# Altium schematic sheet PMP30825_RevB.SchDoc (part 2 of 2)
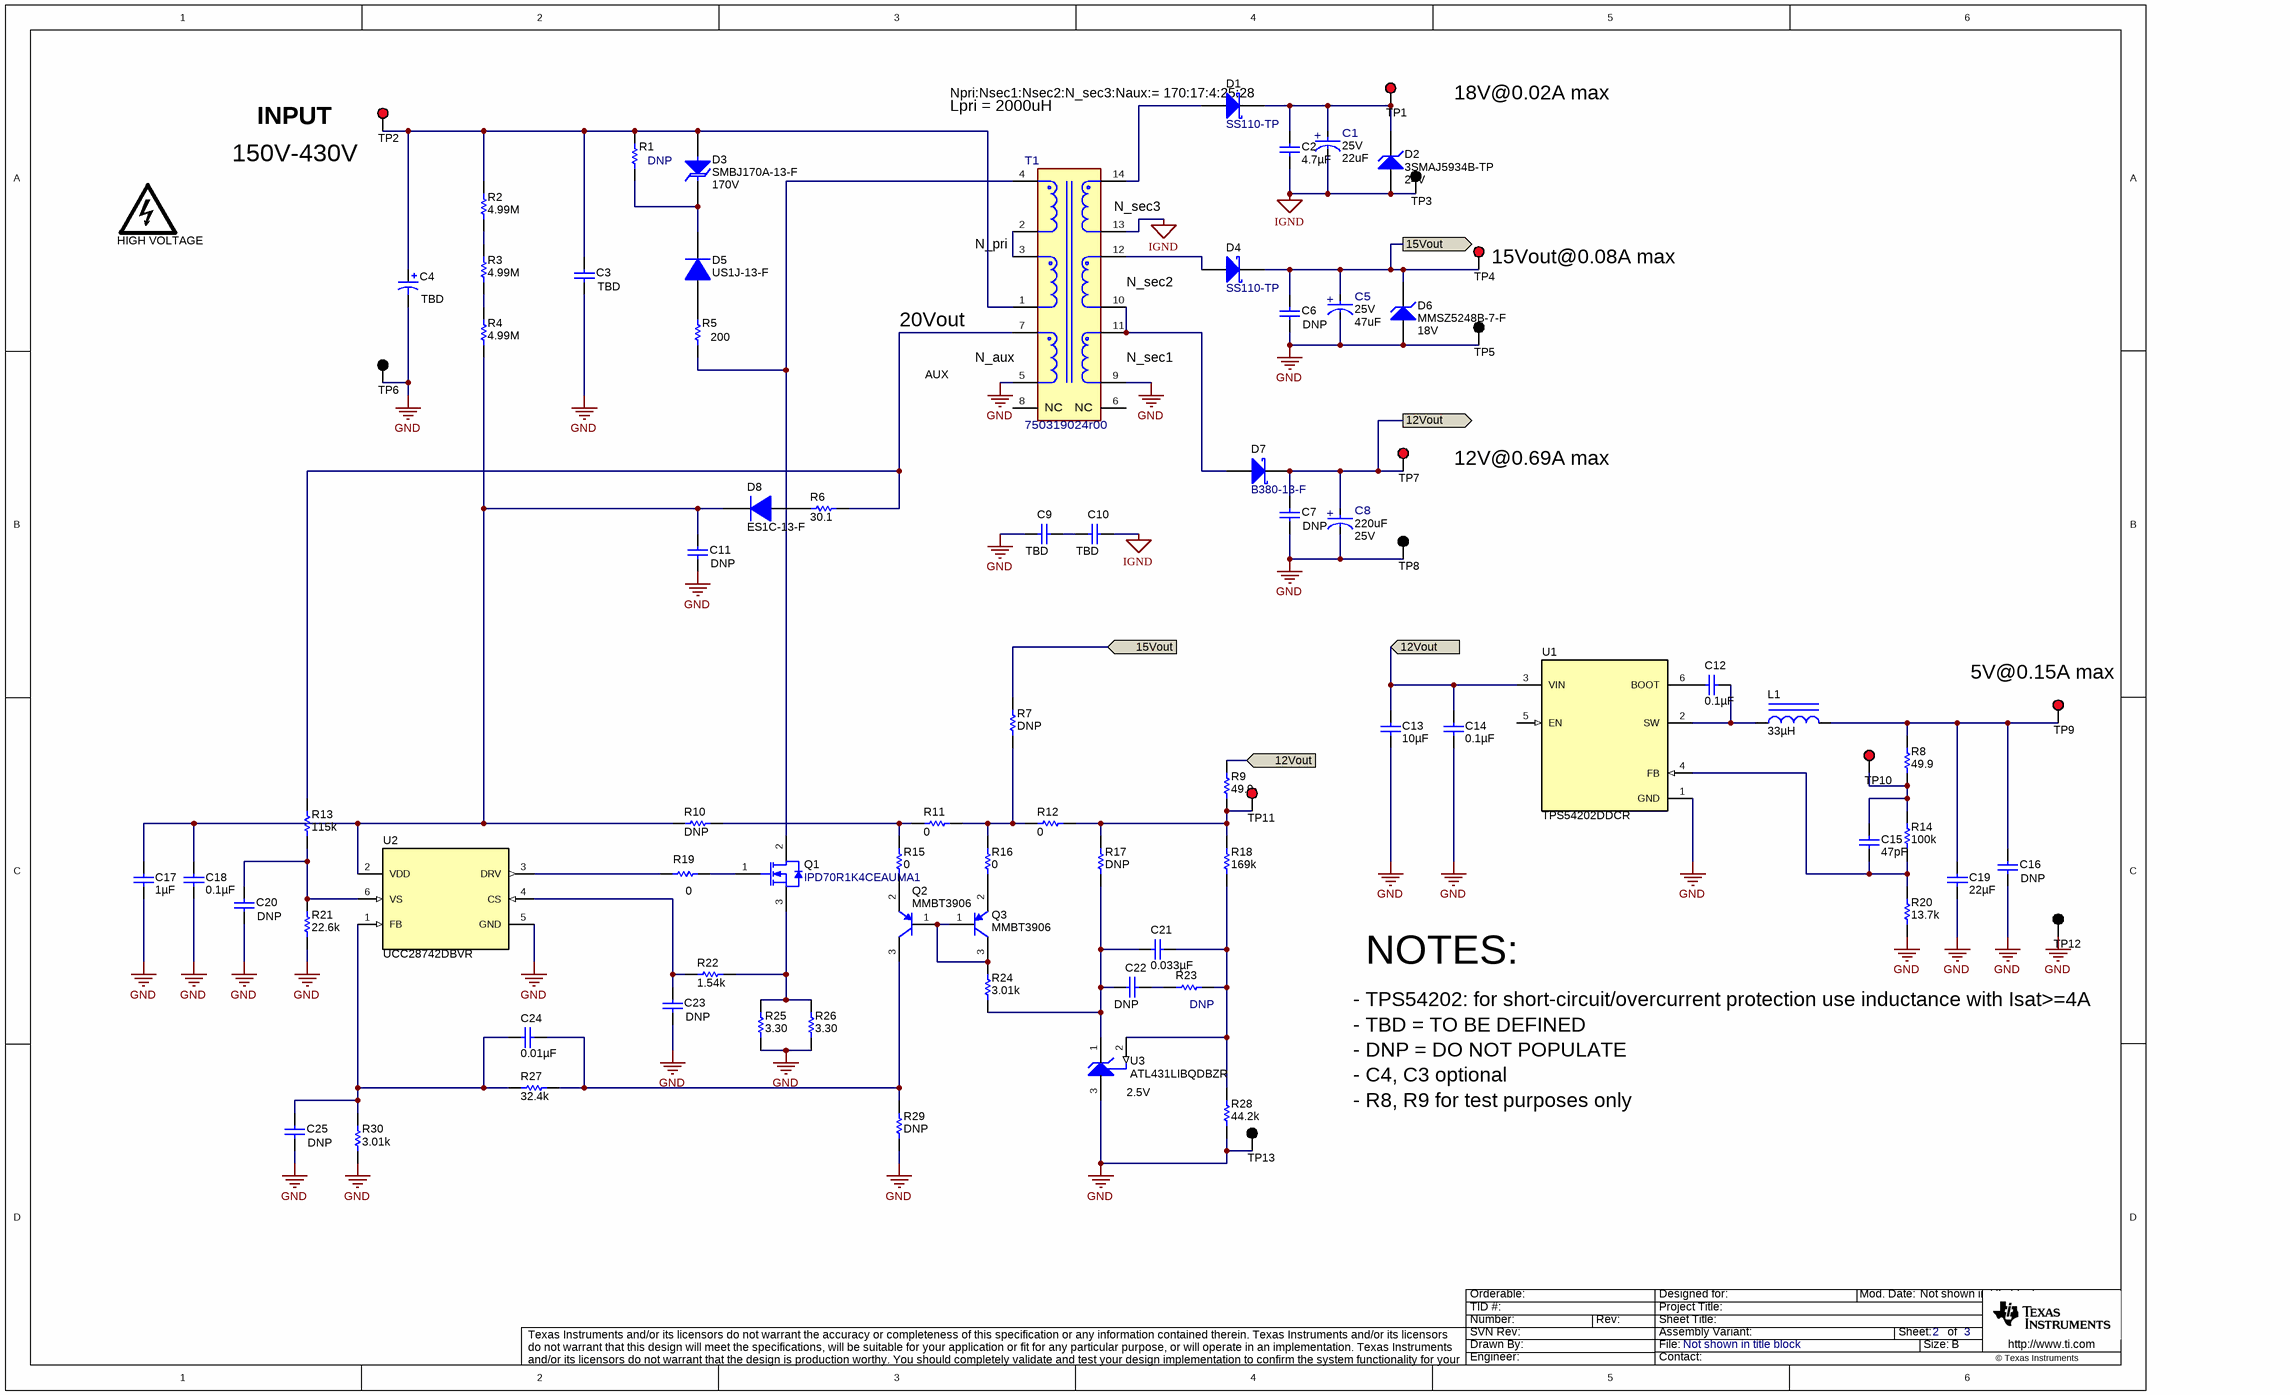
[diagram p1: PMP30825_RevB.SchDoc]

## Library data of the parts
C1 = CMP-0088544-1: 22uF 25 V dc Aluminium Electrolytic Capacitor, PW Series 2000h 5 (Dia.) x 11mm; Manufacturer: Nichicon; AEC Grade: Grade 2; IRMS_A: 180mA; Dissipation Factor: 14%; Cap_F: 22µF; Leakage Current: 16.5uA; SizeZ_mm: 12.5mm; Life: 2000Hours; AEC Qualified: Yes; Tolerance_%: 20%; helpURL: https://upverter.com/upn/revision/dc22ef000e10bc70/; Lead Free: Yes; Supplier 1: Digikey; Datasheet Path: datasheets/Cap-UPW1E220MDD.pdf; PackageReference: RADIAL; datasheet: https://products.nichicon.co.jp/en/pdf/XJA043/e-upw.pdf; ComponentLink1Description: Datasheet; RoHS: TRUE; Operating Temperature Range: -55°C to +105°C; Supplier Part Number 2: 647-UPW1E220MDD; PartNumber: UPW1E220MDD; Supplier Part Number 1: 493-1811-ND; Mouser Part Number: 647-UPW1E220MDD; Supplier 2: Mouser; Digikey Part Number: 493-1811-ND; Digikey Description: CAP ALUM 22UF 20% 25V RADIAL; ComponentLink1URL: https://products.nichicon.co.jp/en/pdf/XJA043/e-upw.pdf
C2 = C3216X7R1H475K160AC: CAP, CERM, 4.7 µF, 50 V,+/- 10%, X7R, 1206; Manufacturer: TDK; Polarized: N; CompType: Capacitor; Value: 4.7uF; U/M: EA; Cap_F: 0.0000047; Tolerance_%: 10; ESR_ohm: 0.003158; Value1: 0.003158 ohm; VDC_V: 50; Value2: 50V; IRMS_A: 4.08379; TaMin_C: -55; TaMax_C: 125; Cap_Case: 1206; SizeArea_mm2: 5.12; SizeAreaWB_mm2: 10.92; SizeX_mm: 3.2; SizeY_mm: 1.6; SizeZ_mm: 1.8; AEC Category: Q200; SymbolVersion: 2008-07-09; PartNumber: C3216X7R1H475K160AC; PackageReference: 1206; RoHS: Y; MountType: SMT; Technology: Ceramic; TempCo: X7R; Published: 2008-06-19; Publisher: Texas Instruments; LatestRevisionDate: 2017-06-22; ComponentLink1Description: Datasheet link; ComponentLink1URL: https://product.tdk.com/en/search/capacitor/ceramic/mlcc/info?part_no=C3216X7R1H475K160AC; Supplier 1: Digi-Key; Supplier Part Number 1: 445-8032-1-ND; Supplier 2: Mouser; Supplier Part Number 2: 810-C3216X7R1H475K160AC; AEC Qualified: N; AEC Grade: N/A
C3 = Capacitor: CAP, CERM, 1uF,500V, [TempCo], xx%, [PackageReference]; Manufacturer: Knowles Syfer; Polarized: N; U/M: EA; CompType: Capacitor; SymbolVersion: 2008-07-09; PackageReference: 2220; PartNumber: 2220Y5000105KXTWS3; RoHS: Used in BOM report.  Use Y or N.; MountType: SMT or TH (used in PnP report); ComponentLink1Description: Datasheet Link; ComponentLink1URL: Paste URL for datasheet here; Publisher: Texas Instruments; LatestRevisionDate: 2017-05-31; LatestRevisionNote: Added Alternate PartNumber and Alternate Manufacturer parameters to appropriate components.; Alternate Manufacturer: -; Alternate PartNumber: -
C4 = EEU-ED2W150: CAP, AL, 15 µF, 450 V, +/- 20%, TH; Manufacturer: Panasonic; Polarized: Y; CompType: Capacitor; ValueDisplayed: 15µF; U/M: EA; Cap_F: 0.000015; Tolerance_%: 20; VDC_V: 450; Value2: 450V; IRMS_A: 0.56; TaMin_C: -25; TaMax_C: 105; Cap_Case: 12.5x25mm; SizeAreaWB_mm2: 210.25; SizeArea_mm2: 156.25; SizeX_mm: 12.5; SizeZ_mm: 27; AEC Category: Q200; AEC Qualified: N; SymbolVersion: 2008-07-09; PartNumber: EEU-ED2W150; PackageReference: D12.5xL25mm; RoHS: Y; MountType: TH; Technology: AL; Series: ED; SizeY_mm: 12.5; Publisher: Texas Instruments; LatestRevisionDate: 2017-06-22; ComponentLink1Description: Datasheet link; ComponentLink1URL: http://industrial.panasonic.com/cdbs/www-data/pdf/RDF0000/ABA0000CE86.pdf; Supplier 1: Digi-Key; Supplier Part Number 1: P13559-ND; Supplier 2: Newark; Supplier Part Number 2: 96K9475; Supplier 3: Mouser; Supplier Part Number 3: 667-EEU-ED2W150; AEC Grade: N/A
C5 = CMP-0088537-1: Cap Aluminum 47uF 25V 20% (6.3 X 7mm) Radial 2.5mm 480mA 1000 hr 105°C Bulk; Manufacturer: Rubycon; AEC Qualified: No; Dissipation Factor: 14%; Leakage Current: 35.25uA; Cap_F: 47µF; Life: 1000Hours; SizeZ_mm: 8mm; PackageReference: RADIAL; Supplier 2: Mouser; datasheet: http://www.rubycon.co.jp/en/catalog/e_pdfs/aluminum/e_ZLG.pdf; RoHS: TRUE; Digikey Description: CAP ALUM 47UF 20% 25V RADIAL; ComponentLink1URL: http://www.rubycon.co.jp/en/catalog/e_pdfs/aluminum/e_ZLG.pdf; Operating Temperature Range: -40°C to +105°C; Digikey Part Number: 1189-4172-ND; Lead Free: Yes; Tolerance_%: 20%; Supplier 1: Digikey; ComponentLink1Description: Datasheet; Supplier Part Number 2: 232-25ZLG47MEFC6.3X7; Supplier Part Number 1: 1189-4172-ND; Datasheet Path: datasheets/Cap-25ZLG47MEFC6.3X7.pdf; helpURL: https://upverter.com/upn/revision/d1e3d443faba1285/; PartNumber: 25ZLG47MEFC6.3X7; Mouser Part Number: 232-25ZLG47MEFC6.3X7; IRMS_A: 480mA
C6 C7 C11 C16 C22 C25 = Capacitor: CAP, CERM, xxxF, xxV, [TempCo], xx%, [PackageReference]; Manufacturer: Used in BOM report; Polarized: N; U/M: EA; CompType: Capacitor; SymbolVersion: 2008-07-09; PackageReference: Used in PnP output and some BOM reports; PartNumber: DNP; RoHS: Used in BOM report.  Use Y or N.; MountType: SMT or TH (used in PnP report); ComponentLink1Description: Datasheet Link; ComponentLink1URL: Paste URL for datasheet here; Publisher: Texas Instruments; LatestRevisionDate: 2017-05-31; LatestRevisionNote: Added Alternate PartNumber and Alternate Manufacturer parameters to appropriate components.; Alternate Manufacturer: -; Alternate PartNumber: -
  C6 C7 C11: Value: *
  C16 C22 C25: Value: DNP
C8 = CMP-0088565-1: 220µF 25V Aluminum Electrolytic Capacitors Radial, Can 2000 Hrs @ 105°C; Manufacturer: Rubycon; SizeZ_mm: 10.5mm; AEC Qualified: No; Tolerance_%: 20%; Leakage Current: 55uA; Life: 2000Hours; Dissipation Factor: 14%; IRMS_A: 1.36A; Cap_F: 220µF; Mouser Part Number: 232-25AX220MEFC8X9; Supplier 2: Mouser; Supplier Part Number 2: 232-25AX220MEFC8X9; ComponentLink1URL: http://www.rubycon.co.jp/en/catalog/e_pdfs/aluminum/e_AX.pdf; Datasheet Path: datasheets/Cap-25AX220MEFC8X9.pdf; RoHS: TRUE; Supplier 1: Digikey; Lead Free: Yes; Digikey Part Number: 1189-2906-ND; Digikey Description: CAP ALUM 220UF 20% 25V RADIAL; Operating Temperature Range: -40°C to +105°C; PackageReference: RADIAL; datasheet: http://www.rubycon.co.jp/en/catalog/e_pdfs/aluminum/e_AX.pdf; PartNumber: 25AX220MEFC8X9; ComponentLink1Description: Datasheet; Supplier Part Number 1: 1189-2906-ND; helpURL: https://upverter.com/upn/revision/a3c110b3ba59c556/
C9 C10 = DE2E3KY472MB3BM02F: CAP, CERM, 4700 pF, X1 250 VAC/Y2 300 VAC, +/- 20%, E, 10x5x13mm; Manufacturer: MuRata; Polarized: N; CompType: Capacitor; U/M: EA; Cap_F: 0.0000000047; Tolerance_%: 20; TaMin_C: -40; TaMax_C: 125; SizeArea_mm2: 50; SizeAreaWB_mm2: 84; SizeX_mm: 10; SizeY_mm: 5; SizeZ_mm: 13; AEC Category: Q200; AC_Safety: X1Y2; VAC_X: 250; VAC_Y: 300; SymbolVersion: 2008-07-09; Value: TBD; PartNumber: TBD; ValueDisplayed: TBD; PackageReference: 10x5x13mm; RoHS: Y; MountType: TH; Technology: Ceramic; TempCo: E; Cap_Case: 10x5x13mm; Published: 2008-06-19; Publisher: Texas Instruments; LatestRevisionDate: 2017-06-22; ComponentLink1Description: Datasheet link; ComponentLink1URL: http://psearch.en.murata.com/capacitor/product/DE2E3KY472MB3BM02F.pdf; Supplier 1: Digi-Key; Supplier Part Number 1: 490-9484-ND; Supplier 2: Mouser; Supplier Part Number 2: 81-DE2E3KY472MB3BM2F; AEC Qualified: N; AEC Grade: N/A
C12 = GRM188R71H104KA93D: CAP, CERM, 0.1 µF, 50 V,+/- 10%, X7R, 0603; Manufacturer: MuRata; Polarized: N; CompType: Capacitor; Value: 0.1uF; U/M: EA; Cap_F: 0.0000001; Tolerance_%: 10; VDC_V: 50; Value2: 50V; TaMin_C: -55; TaMax_C: 125; SizeArea_mm2: 1.28; SizeAreaWB_mm2: 4.68; SizeX_mm: 1.6; SizeY_mm: 0.8; SizeZ_mm: 1; AEC Category: Q200; Green_Lifecycle: Active; Green_REACh: Passed; SymbolVersion: 2008-07-09; PartNumber: GRM188R71H104KA93D; PackageReference: 0603; RoHS: Y; MountType: SMT; Technology: Ceramic; TempCo: X7R; Cap_Case: 0603; Published: 2008-06-19; Publisher: Texas Instruments; LatestRevisionDate: 2017-06-22; ComponentLink1Description: Datasheet link; ComponentLink1URL: http://search.murata.co.jp/Ceramy/PnsearchViewAction.do?HnOFG=ON&HnNFG=ON&SEL_CNT=50&sLang=en&sKey=GRM188R71H104KA93D&x=9&y=9&search=startwith; Supplier 1: Digi-Key; Supplier Part Number 1: 490-1519-1-ND; Supplier 2: Mouser; Supplier Part Number 2: 81-GRM39X104K50D; Supplier 3: Farnell; Supplier Part Number 3: 8820023; AEC Qualified: ?; Green_EU RoHS: Passed; Green_EU RoHS-2: Incomplete
C13 = GRM31CR71E106KA12L: CAP, CERM, 10 µF, 25 V,+/- 10%, X7R, 1206; Manufacturer: MuRata; Polarized: N; CompType: Capacitor; Value: 10uF; U/M: EA; Cap_F: 0.00001; Tolerance_%: 10; VDC_V: 25; Value2: 25V; TaMin_C: -55; TaMax_C: 125; Cap_Case: 1206; SizeArea_mm2: 5.12; SizeAreaWB_mm2: 10.92; SizeX_mm: 3.2; SizeY_mm: 1.6; SizeZ_mm: 1.8; AEC Category: Q200; Green_Lifecycle: Active; Green_REACh: Passed; SymbolVersion: 2008-07-09; PartNumber: GRM31CR71E106KA12L; PackageReference: 1206; RoHS: Y; MountType: SMT; Technology: Ceramic; TempCo: X7R; Published: 2008-06-19; Publisher: Texas Instruments; LatestRevisionDate: 2017-06-22; ComponentLink1Description: Datasheet link; ComponentLink1URL: http://search.murata.co.jp/Ceramy/PnsearchViewAction.do?HnOFG=ON&HnNFG=ON&SEL_CNT=50&sLang=en&sKey=GRM31CR71E106KA12L&x=9&y=9&search=startwith; Supplier 1: Mouser; Supplier Part Number 1: 81-GRM31CR71E106KA12; Supplier 2: Farnell; Supplier Part Number 2: 1828837; AEC Qualified: ?; Green_EU RoHS: Passed; Green_EU RoHS-2: Incomplete
C14 = GRM188R71E104KA01D: CAP, CERM, 0.1 µF, 25 V,+/- 10%, X7R, 0603; Manufacturer: MuRata; Polarized: N; CompType: Capacitor; Value: 0.1uF; U/M: EA; Cap_F: 0.0000001; Tolerance_%: 10; VDC_V: 25; Value2: 25V; TaMin_C: -55; TaMax_C: 125; SizeArea_mm2: 1.28; SizeAreaWB_mm2: 4.68; SizeX_mm: 1.6; SizeY_mm: 0.8; SizeZ_mm: 1; AEC Category: Q200; Green_Lifecycle: Active; Green_REACh: Passed; SymbolVersion: 2008-07-09; PartNumber: GRM188R71E104KA01D; PackageReference: 0603; RoHS: Y; MountType: SMT; Technology: Ceramic; TempCo: X7R; Cap_Case: 0603; Published: 2008-06-19; Publisher: Texas Instruments; LatestRevisionDate: 2017-06-22; ComponentLink1Description: Datasheet link; ComponentLink1URL: http://search.murata.co.jp/Ceramy/PnsearchViewAction.do?HnOFG=ON&HnNFG=ON&SEL_CNT=50&sLang=en&sKey=GRM188R71E104KA01D&x=9&y=9&search=startwith; Supplier 1: Digi-Key; Supplier Part Number 1: 490-1524-1-ND; Supplier 2: Mouser; Supplier Part Number 2: 81-GRM39X104K25; Supplier 3: Farnell; Supplier Part Number 3: 1828899; AEC Qualified: ?; Green_EU RoHS: Passed; Green_EU RoHS-2: Passed
C15 = GRM1885C1H470JA01D: CAP, CERM, 47 pF, 50 V,+/- 5%, C0G/NP0, 0603; Manufacturer: MuRata; Polarized: N; CompType: Capacitor; Value: 47pF; U/M: EA; Cap_F: 0.000000000047; Tolerance_%: 5; VDC_V: 50; Value2: 50V; TaMin_C: -55; TaMax_C: 125; SizeArea_mm2: 1.28; SizeAreaWB_mm2: 4.68; SizeX_mm: 1.6; SizeY_mm: 0.8; SizeZ_mm: 1; AEC Category: Q200; Green_Lifecycle: Active; Green_REACh: Passed; SymbolVersion: 2008-07-09; PartNumber: GRM1885C1H470JA01D; PackageReference: 0603; RoHS: Y; MountType: SMT; Technology: Ceramic; TempCo: C0G/NP0; Cap_Case: 0603; Published: 2008-06-19; Publisher: Texas Instruments; LatestRevisionDate: 2017-06-22; ComponentLink1Description: Datasheet link; ComponentLink1URL: http://search.murata.co.jp/Ceramy/PnsearchViewAction.do?HnOFG=ON&HnNFG=ON&SEL_CNT=50&sLang=en&sKey=GRM1885C1H470JA01D&x=9&y=9&search=startwith; Supplier 1: Digi-Key; Supplier Part Number 1: 490-1419-1-ND; Supplier 2: Mouser; Supplier Part Number 2: 81-GRM39C470J50; Supplier 3: Farnell; Supplier Part Number 3: 8819840; AEC Qualified: ?; Green_EU RoHS: Passed; Green_EU RoHS-2: Incomplete
C17 = GRM21BR71H105KA12L: CAP, CERM, 1 µF, 50 V,+/- 10%, X7R, 0805; Manufacturer: MuRata; Polarized: N; CompType: Capacitor; Value: 1uF; U/M: EA; Cap_F: 0.000001; Tolerance_%: 10; VDC_V: 50; Value2: 50V; TaMin_C: -55; TaMax_C: 125; Cap_Case: 0805; SizeArea_mm2: 2.5; SizeAreaWB_mm2: 6.75; SizeX_mm: 2; SizeY_mm: 1.25; SizeZ_mm: 1.45; AEC Category: Q200; Green_Lifecycle: Active; Green_REACh: Passed; SymbolVersion: 2008-07-09; PartNumber: GRM21BR71H105KA12L; PackageReference: 0805; RoHS: Y; MountType: SMT; Technology: Ceramic; TempCo: X7R; Published: 2008-06-19; Publisher: Texas Instruments; LatestRevisionDate: 2017-06-22; ComponentLink1Description: Datasheet link; ComponentLink1URL: http://search.murata.co.jp/Ceramy/PnsearchViewAction.do?HnOFG=ON&HnNFG=ON&SEL_CNT=50&sLang=en&sKey=GRM21BR71H105KA12L&x=9&y=9&search=startwith; Supplier 1: Digi-Key; Supplier Part Number 1: 490-4736-1-ND; Supplier 2: Mouser; Supplier Part Number 2: 81-GRM21BR71H105KA2L; Supplier 3: Farnell; Supplier Part Number 3: 1735541; AEC Qualified: ?; Green_EU RoHS: Passed; Green_EU RoHS-2: Passed
C18 = C0805C104J5RACTU: CAP, CERM, 0.1 µF, 50 V,+/- 5%, X7R, 0805; Manufacturer: Kemet; Polarized: N; CompType: Capacitor; Value: 0.1uF; U/M: EA; Cap_F: 0.0000001; Tolerance_%: 5; ESR_ohm: 0.064; Value1: 0.064 ohm; VDC_V: 50; Value2: 50V; IRMS_A: 1.64; TaMin_C: -55; TaMax_C: 125; Cap_Case: 0805; SizeArea_mm2: 2.5; SizeAreaWB_mm2: 6.75; SizeX_mm: 2; SizeY_mm: 1.25; SizeZ_mm: 1.45; AEC Category: Q200; Green_Lifecycle: Active; Green_REACh: Passed; SymbolVersion: 2008-07-09; PartNumber: C0805C104J5RACTU; PackageReference: 0805; RoHS: Y; MountType: SMT; Technology: Ceramic; TempCo: X7R; Published: 2008-06-19; Publisher: Texas Instruments; LatestRevisionDate: 2017-06-22; ComponentLink1Description: Datasheet link; ComponentLink1URL: http://www.kemet.com/kemet/web/homepage/kechome.nsf/file/Partial%20Copy%20-%20Ceramic%20Surface%20Mount%20Capacitors/$file/F3102_CE.pdf; Supplier 1: Newark; Supplier Part Number 1: 64K2889; Supplier 2: Mouser; Supplier Part Number 2: 80-C0805C104J5R; Supplier 3: Farnell; Supplier Part Number 3: 1414663; AEC Qualified: ?; Green_EU RoHS: Passed; Green_EU RoHS-2: Passed
C19 = GRM31CR71A226KE15L: CAP, CERM, 22 µF, 10 V,+/- 10%, X7R, 1206; Manufacturer: MuRata; Polarized: N; CompType: Capacitor; Value: 22uF; U/M: EA; Cap_F: 0.000022; Tolerance_%: 10; Value2: 10V; TaMin_C: -55; TaMax_C: 125; Cap_Case: 1206; SizeArea_mm2: 5.12; SizeAreaWB_mm2: 10.92; SizeX_mm: 3.2; SizeY_mm: 1.6; SizeZ_mm: 1.8; AEC Category: Q200; Green_Lifecycle: Active; Green_REACh: Passed; SymbolVersion: 2008-07-09; PartNumber: GRM31CR71A226KE15L; PackageReference: 1206; RoHS: Y; VDC_V: 10; MountType: SMT; Technology: Ceramic; TempCo: X7R; Published: 2008-06-19; Publisher: Texas Instruments; LatestRevisionDate: 2017-06-22; ComponentLink1Description: Datasheet link; ComponentLink1URL: http://search.murata.co.jp/Ceramy/PnsearchViewAction.do?HnOFG=ON&HnNFG=ON&SEL_CNT=50&sLang=en&sKey=GRM31CR71A226KE15L&x=9&y=9&search=startwith; Supplier 1: Digi-Key; Supplier Part Number 1: 490-5309-1-ND; Supplier 2: Mouser; Supplier Part Number 2: 81-GRM31CR71A226K15L; Supplier 3: Farnell; Supplier Part Number 3: 1797016; AEC Qualified: ?; Green_EU RoHS: Passed; Green_EU RoHS-2: Incomplete
C20 C23 = Capacitor: CAP, CERM, xxxF, xxV, [TempCo], xx%, [PackageReference]; Polarized: N; U/M: EA; CompType: Capacitor; SymbolVersion: 2008-07-09; PackageReference: Used in PnP output and some BOM reports; Manufacturer: Used in BOM report; PartNumber: Used in BOM report; RoHS: Used in BOM report.  Use Y or N.; MountType: SMT or TH (used in PnP report); ComponentLink1Description: Datasheet Link; ComponentLink1URL: Paste URL for datasheet here; Publisher: Texas Instruments; LatestRevisionDate: 2016-08-13; LatestRevisionNote: Added Alternate PartNumber and Alternate Manufacturer parameters to appropriate components.; Alternate Manufacturer: -; Alternate PartNumber: -
C21 = 08055C333JAT2A: CAP, CERM, 0.033 µF, 50 V,+/- 5%, X7R, 0805; Manufacturer: AVX; Polarized: N; CompType: Capacitor; Value: 0.033uF; U/M: EA; Cap_F: 0.000000033; Tolerance_%: 5; ESR_ohm: 0.042; Value1: 0.042 ohm; VDC_V: 50; Value2: 50V; TaMin_C: -55; TaMax_C: 125; Cap_Case: 0805; SizeArea_mm2: 2.5; SizeAreaWB_mm2: 6.75; SizeX_mm: 2; SizeY_mm: 1.25; SizeZ_mm: 1.45; AEC Category: Q200; Green_Lifecycle: Not Set; Green_REACh: Incomplete; SymbolVersion: 2008-07-09; PartNumber: 08055C333JAT2A; PackageReference: 0805; RoHS: Y; MountType: SMT; Technology: Ceramic; TempCo: X7R; Published: 2008-06-19; Publisher: Texas Instruments; LatestRevisionDate: 2017-06-22; ComponentLink1Description: Datasheet link; ComponentLink1URL: http://datasheets.avx.com/X7RDielectric.pdf; Supplier 1: Digi-Key; Supplier Part Number 1: 478-3769-1-ND; Supplier 2: Newark; Supplier Part Number 2: 96M1411; Supplier 3: Mouser; Supplier Part Number 3: 581-08055C333JAT2A; AEC Qualified: N; AEC Grade: N/A; Green_EU RoHS: Incomplete; Green_EU RoHS-2: Incomplete
C24 = C0603X103K5RACTU: CAP, CERM, 0.01 µF, 50 V,+/- 10%, X7R, 0603; Manufacturer: Kemet; Polarized: N; CompType: Capacitor; Value: 0.01uF; U/M: EA; Cap_F: 0.00000001; Tolerance_%: 10; VDC_V: 50; Value2: 50V; TaMin_C: -55; TaMax_C: 125; SizeArea_mm2: 1.28; SizeAreaWB_mm2: 4.68; SizeX_mm: 1.6; SizeY_mm: 0.8; SizeZ_mm: 1; AEC Category: Q200; Green_Lifecycle: Active; Green_REACh: Passed; SymbolVersion: 2008-07-09; PartNumber: C0603X103K5RACTU; PackageReference: 0603; RoHS: Y; MountType: SMT; Technology: Ceramic; TempCo: X7R; Cap_Case: 0603; Published: 2008-06-19; Publisher: Texas Instruments; LatestRevisionDate: 2017-06-22; ComponentLink1Description: Datasheet link; ComponentLink1URL: http://www.kemet.com/kemet/web/homepage/kechome.nsf/vapubfiles/F3102_Y5V.pdf/$file/F3102_Y5V.pdf; Supplier 1: Digi-Key; Supplier Part Number 1: 399-5346-1-ND; Supplier 2: Mouser; Supplier Part Number 2: 80-C0603X103K5R; Supplier 3: Farnell; Supplier Part Number 3: 1414026; AEC Qualified: ?; Green_EU RoHS: Passed; Green_EU RoHS-2: Passed
D1 D4 = CMP-0028597-2: Diode, Schottky, 100 V, 1 A, SMA; Manufacturer: Micro Commercial Components; Value2: 0.85V; Vf_V: 850mV; Vr_V: 100V; Value: 100V; AEC Category: Q101; SizeZ_mm: 2.87; SizeX_mm: 5.59; TJmax_C: 125°C; SizeArea_mm2: 16.3228; Green_Lifecycle: Not Set; AEC Qualified: N; SizeY_mm: 2.92; Io_A: 1A; SizeAreaWB_mm2: 37.3428; Green_REACh: Incomplete; Type: Schottky; PartNumber: SS110-TP; RoHS: Y; MountType: SMT; ComponentLink1Description: Datasheet link; CompType: Diode; PackageReference: SMA; ComponentLink1URL: http://www.mccsemi.com/up_pdf/SS12-SS110%28HSMA%29.PDF; Green_EU RoHS-2: Incomplete; Green_EU RoHS: Incomplete; Value1: 1A
D2 = 3SMAJ5934B-TP: Diode, Zener, 24 V, 3 W, SMA; Manufacturer: Micro Commercial Components; SymbolCreator: a0412235; U/M: EA; Power_W: 3; Vz_V: 24; Value1: 3W; RJA_CperW: 226; SizeAreaWB_mm2: 37.3428; SizeArea_mm2: 16.3228; SizeX_mm: 5.59; SizeY_mm: 2.92; SizeZ_mm: 2.87; AEC Category: Q101; SymbolVersion: 2010-08-25; PartNumber: 3SMAJ5934B-TP; PackageReference: SMA; CompType: Zener; Vr_V: N/A; MountType: SMT; RoHS: Y; ComponentLink1Description: Datasheet link; ComponentLink1URL: http://61.222.192.61/mccsemi/up_pdf/3SMAJ5913B%7E3SMAJ5943B(DO-214AC).pdf; Published: 2008-10-08; Publisher: Texas Instruments; LatestRevisionDate: 2017-06-20; LatestRevisionNote: Updated Supplier Data; Supplier 1: Digi-Key; Supplier Part Number 1: 3SMAJ5934B-TPMSCT-ND; Supplier 2: Mouser; Supplier Part Number 2: 833-3SMAJ5934B-TP; AEC Qualified: ?
D3 = SMBJ170A-13-F: Diode, TVS, Uni, 170 V, 275 Vc, SMB; Manufacturer: Diodes Inc.; U/M: EA; Power_W: 5; Vr_V: 170; Value1: 5W; SizeAreaWB_mm2: 44.156; SizeArea_mm2: 21.336; SizeX_mm: 5.6; SizeY_mm: 3.81; SizeZ_mm: 2.6; AEC Category: Q101; CompType: TVS; SymbolVersion: 2012-01-13; PartNumber: SMBJ170A-13-F; PackageReference: SMB; Vz_V: N/A; MountType: SMT; RoHS: Y; ComponentLink1Description: Datasheet link; ComponentLink1URL: http://www.diodes.com/datasheets/ds19002.pdf; Published: 2008-10-08; Publisher: Texas Instruments; LatestRevisionDate: 2017-06-20; LatestRevisionNote: Updated Supplier Data; Supplier 1: Digi-Key; Supplier Part Number 1: SMBJ170A-FDICT-ND; Supplier 2: Mouser; Supplier Part Number 2: 621-SMBJ170A-13-F; AEC Qualified: ?
D5 = US1J-13-F: Diode, Ultrafast, 600 V, 1 A, SMA; Manufacturer: Diodes Inc.; U/M: EA; Vf_V: 1.7; Value: 600V; Value1: 1A; Value2: 1.7V; Io_A: 1; Vr_V: 600; TJmax_C: 150; SizeAreaWB_mm2: 37.3428; SizeArea_mm2: 16.3228; SizeX_mm: 5.59; SizeY_mm: 2.92; SizeZ_mm: 2.87; AEC Category: Q101; Green_Lifecycle: Active; Green_REACh: Passed; SymbolVersion: 2008-12-08; PartNumber: US1J-13-F; PackageReference: SMA; CompType: Diode; MountType: SMT; Type: Ultrafast; RoHS: Y; Published: 2008-06-26; Publisher: Texas Instruments; LatestRevisionDate: 2017-06-19; ComponentLink1Description: Datasheet link; ComponentLink1URL: http://www.diodes.com/datasheets/ds16008.pdf; Supplier 1: Digi-Key; Supplier Part Number 1: US1J-FDICT-ND; Supplier 2: Newark; Supplier Part Number 2: 12T2262; Supplier 3: Mouser; Supplier Part Number 3: 621-US1J-F; AEC Qualified: ?; Green_EU RoHS: Passed with Exemption; Green_EU RoHS-2: Passed
D6 = MMSZ5248B-7-F: Diode, Zener, 18 V, 500 mW, SOD-123; Manufacturer: Diodes Inc.; SymbolCreator: a0412235; U/M: EA; Power_W: 0.5; Vz_V: 18; Value1: 0.5W; RJA_CperW: 350; SizeAreaWB_mm2: 13.095; SizeArea_mm2: 6.545; SizeX_mm: 3.85; SizeY_mm: 1.7; SizeZ_mm: 1.35; AEC Category: Q101; Green_Lifecycle: Active; Green_REACh: Passed; SymbolVersion: 2010-08-25; PartNumber: MMSZ5248B-7-F; PackageReference: SOD-123; CompType: Zener; Vr_V: N/A; MountType: SMT; RoHS: Y; ComponentLink1Description: Datasheet link; ComponentLink1URL: http://www.diodes.com/datasheets/ds18010.pdf; Published: 2008-10-08; Publisher: Texas Instruments; LatestRevisionDate: 2017-06-20; LatestRevisionNote: Updated Supplier Data; Supplier 1: Digi-Key; Supplier Part Number 1: MMSZ5248B-FDICT-ND; Supplier 2: Mouser; Supplier Part Number 2: 621-MMSZ5248B-F; Supplier 3: Farnell; Supplier Part Number 3: 2061483; AEC Qualified: ?; Green_EU RoHS: Passed; Green_EU RoHS-2: Passed
D7 = CMP-0028422-1: Diode, Schottky, 80 V, 3 A, SMC; Manufacturer: Diodes Inc.; Io_A: 3A; Green_Lifecycle: Active; SizeAreaWB_mm2: 83.2686; Vr_V: 80V; Green_REACh: Passed; TJmax_C: 125°C; U/M: EA; Value: 80V; SizeZ_mm: 2.6; SizeX_mm: 8.13; SizeY_mm: 6.22; Vf_V: 790mV; Value2: 0.79V; SizeArea_mm2: 50.5686; AEC Category: Q101; RJC_CperW: 10; ComponentLink1URL: http://www.diodes.com/datasheets/ds30020.pdf; Supplier Part Number 2: 621-B380-F; Publisher: Texas Instruments; Supplier 2: Mouser; Published: 2008-06-26; RoHS: Y; Value1: 3A; MountType: SMT; Green_EU RoHS-2: Passed; Supplier 1: Digi-Key; Green_EU RoHS: Passed with Exemption; PackageReference: SMC; CompType: Diode; Type: Schottky; LatestRevisionDate: 2017-05-08; PartNumber: B380-13-F; AEC Qualified: ?; ComponentLink1Description: Datasheet link; Supplier Part Number 1: B380-FDICT-ND
D8 = ES1C-13-F: Diode, Superfast Rectifier, 150 V, 1 A, SMA; Manufacturer: Diodes Inc.; U/M: EA; Vf_V: 0.92; Value: 150V; Value1: 1A; Value2: 0.92V; Io_A: 1; Vr_V: 150; RJC_CperW: 25; SizeAreaWB_mm2: 37.3428; SizeArea_mm2: 16.3228; SizeX_mm: 5.59; SizeY_mm: 2.92; SizeZ_mm: 2.87; AEC Category: Q101; Green_Lifecycle: Not Set; Green_REACh: Incomplete; SymbolVersion: 2008-12-08; PartNumber: ES1C-13-F; PackageReference: SMA; CompType: Diode; TJmax_C: 150; MountType: SMT; Type: Superfast Rectifier; RoHS: Y; Published: 2008-06-26; Publisher: Texas Instruments; LatestRevisionDate: 2017-06-19; ComponentLink1Description: Datasheet link; ComponentLink1URL: http://www.diodes.com/datasheets/ds14001.pdf; Supplier 1: Digi-Key; Supplier Part Number 1: ES1C-FDICT-ND; Supplier 2: Mouser; Supplier Part Number 2: 621-ES1C-F; AEC Qualified: ?; Green_EU RoHS: Incomplete; Green_EU RoHS-2: Incomplete
HIGH_VOLTAGE = IEC_HighVoltage: IEC 61010-1 High Voltage Warning; SymbolCreator: a0412235; SymbolVersion: 2011-08-22; Published: 2009-03-03; Publisher: Texas Instruments; LatestRevisionDate: 2016-03-21
L1 = LPS4018-333MLB: Inductor, Shielded Drum Core, Ferrite, 33 µH, 0.68 A, 0.42 ohm, SMD; Manufacturer: Coilcraft; Value: 33uH; Ind_H: 33.0E-6; Imax_A: 0.68; Irms: 0.8A @ 40C rise; Isat: 0.68A @ 30% inductance drop; DCR_ohm: 0.42; Value2: 0.68A; SizeAreaWB_mm2: 24.01; SizeArea_mm2: 15.21; SizeX_mm: 3.9; SizeZ_mm: 1.7; AEC Category: Q200; Green_Lifecycle: Not Set; Green_REACh: Incomplete; SymbolVersion: 2008-07-23; CompType: Inductor; PartNumber: LPS4018-333MLB; Value1: 0.42 ohm; Technology: Shielded Drum Core; MountType: SMT; Material: Ferrite; PackageReference: LPS4018; Published: 2008-06-26; Publisher: Texas Instruments; LatestRevisionDate: 2017-05-12; ComponentLink1Description: Datasheet link; ComponentLink1URL: http://www.coilcraft.com/pdfs/lps4018.pdf; RoHS: Y; SizeY_mm: 3.9; AEC Qualified: ?; Green_EU RoHS: Incomplete; Green_EU RoHS-2: Incomplete
Q1 = CMP-0001262-3: MOSFET, N-CH, 750 V, 5.4 A, DPAK; Alternate Manufacturer: None; Manufacturer: Infineon Technologies; SizeX_mm: 9.91; Value: 750V; SizeAreaWB_mm2: 101.7114; Value2: 10.5 nC; SizeArea_mm2: 64.8114; Vgs_V: 20V; ChMode: Enhancement; SizeY_mm: 6.54; AEC Category: Q101; QgTyp_nC: 10.5; ChType: N; SizeZ_mm: 2.29; IdsMax_A: 5.4A; Supplier Part Number 2: 726-IPD70R1K4CEAUMA1; MountType: SMT; ComponentLink1Description: Datasheet link; CompType: MOSFET; ComponentLink1URL: http://www.infineon.com/dgdl/Infineon-IPD70R1K4CE-DS-v02_00-EN.pdf?fileId=5546d462533600a40153a2a2125c7af1; Supplier Part Number 1: IPD70R1K4CEAUMA1CT-ND; Supplier 1: Digi-Key; VdsMax_V: 750V; Supplier 2: Mouser; AEC Qualified: N; PartNumber: IPD70R1K4CEAUMA1; RoHS: Y; PackageReference: DPAK
Q2 Q3 = MMBT3906, Fairchild Semiconductor: Transistor, PNP, 40 V, 0.2 A, SOT-23; CompType: BJT; PNP: 1; NPN: 0; Vceo_V: 40; Vcesat1_V: 0.25; Value: 40 V; IcRated_A: 0.2; Value1: 0.2 A; HfeMax: 300; TaMin_C: -55; TaMax_C: 150; SizeAreaWB_mm2: 14; SizeArea_mm2: 7.5; SizeX_mm: 2.5; SizeY_mm: 3; SizeZ_mm: 1.1; U/M: EA; AEC Category: Q101; Green_Lifecycle: Active; Green_REACh: Passed; SymbolVersion: 2008-07-31; PartNumber: MMBT3906; Manufacturer: Fairchild Semiconductor; PackageReference: SOT-23; RoHS: Y; Value2: 300; Published: 2008-07-31; LatestRevisionDate: 2017-06-09; Publisher: Texas Instruments; ComponentLink1Description: Datasheet link; ComponentLink1URL: http://www.fairchildsemi.com/ds/MM/MMBT3906.pdf; Supplier 1: Digi-Key; Supplier Part Number 1: MMBT3906FSCT-ND; Supplier 2: Farnell; Supplier Part Number 2: 9846832; MountType: SMT; AEC Qualified: ?; Green_EU RoHS: Passed; Green_EU RoHS-2: Passed
R1 R7 R10 R17 R29 = Resistor: RES, xxx ohm, x%, xW, [PackageReference]; U/M: EA; CompType: Resistor; SymbolVersion: 2009-05-29; PackageReference: Used in PnP output and some BOM reports; Manufacturer: Used in BOM report; PartNumber: Used in BOM report; RoHS: Used in BOM report.  Use Y or N.; MountType: SMT or TH (used in PnP report); ComponentLink1Description: Datasheet Link; ComponentLink1URL: Paste URL for datasheet here; Publisher: Texas Instruments; LatestRevisionNote: Added Alternate PartNumber and Alternate Manufacturer parameters to appropriate components.; Alternate Manufacturer: -; Alternate PartNumber: -
  R1: LatestRevisionDate: 2017-05-31
  R7 R10 R17 R29: LatestRevisionDate: 2016-12-05
R2-R4 = CRCW08054M99FKEA: RES, 4.99 M, 1%, 0.125 W, 0805; Manufacturer: Vishay-Dale; CompType: Resistor; Value: 4.99Meg; Res_ohm: 4990000; Value_Code: 4M99; Tolerance_%: 1; Power_W: 0.125; Value2: 0.125W; VDC_V: 150; TempCo: 100 ppm/C; SizeArea_mm2: 2.5; SizeX_mm: 2; SizeY_mm: 1.25; SizeZ_mm: 1.45; EIA_Code: E96; U/M: EA; AEC Category: Q200; SymbolVersion: 2009-05-29; PartNumber: CRCW08054M99FKEA; PackageReference: 0805; RoHS: Y; Value1: 1%; MountType: SMT; Technology: Thick Film; Published: 2008-06-26; Publisher: Texas Instruments; LatestRevisionDate: 2017-06-23; ComponentLink1Description: Datasheet link; ComponentLink1URL: http://www.vishay.com/docs/20035/dcrcwe3.pdf; Supplier 1: Digi-Key; Supplier Part Number 1: 541-4.99MCCT-ND; Supplier 2: Newark; Supplier Part Number 2: 53K0233; Supplier 3: Mouser; Supplier Part Number 3: 71-CRCW08054M99FKEA; AEC Qualified: ?
R5 = CRCW2512200RJNEG: RES, 200, 5%, 1 W, AEC-Q200 Grade 0, 2512; Manufacturer: Vishay-Dale; CompType: Resistor; Value_Code: 200R; Tolerance_%: 5; Power_W: 1; Value2: 1W; VDC_V: 500; TempCo: 200 ppm/C; SizeArea_mm2: 20.16; SizeX_mm: 6.3; SizeY_mm: 3.2; SizeZ_mm: 0.71; EIA_Code: E24; U/M: EA; AEC Category: Q200; AEC Qualified: Y; AEC Grade: 0; Green_Lifecycle: Active; Green_REACh: Passed; SymbolVersion: 2009-05-29; PartNumber: CRCW2512200RJNEG; ValueDisplayed: 200; PackageReference: 2512; RoHS: Y; Res_ohm: 200; Value1: 5%; MountType: SMT; Technology: Thick Film; Published: 2008-06-26; Publisher: Texas Instruments; LatestRevisionDate: 2017-06-11; ComponentLink1Description: Datasheet link; ComponentLink1URL: http://www.vishay.com/doc?20035; Supplier 1: Digi-Key; Supplier Part Number 1: 541-200XCT-ND; Green_EU RoHS: Passed with Exemption; Green_EU RoHS-2: Passed
R6 = CRCW080530R1FKEA: RES, 30.1, 1%, 0.125 W, 0805; Manufacturer: Vishay-Dale; CompType: Resistor; Value: 30.1; Value_Code: 30R1; Tolerance_%: 1; Power_W: 0.125; Value2: 0.125W; VDC_V: 150; TempCo: 100 ppm/C; SizeArea_mm2: 2.5; SizeX_mm: 2; SizeY_mm: 1.25; SizeZ_mm: 1.45; EIA_Code: E96; U/M: EA; AEC Category: Q200; SymbolVersion: 2009-05-29; PartNumber: CRCW080530R1FKEA; PackageReference: 0805; RoHS: Y; Res_ohm: 30.1; Value1: 1%; MountType: SMT; Technology: Thick Film; Published: 2008-06-26; Publisher: Texas Instruments; LatestRevisionDate: 2017-06-23; ComponentLink1Description: Datasheet link; ComponentLink1URL: http://www.vishay.com/docs/20035/dcrcwe3.pdf; Supplier 1: Digi-Key; Supplier Part Number 1: 541-30.1CCT-ND; Supplier 2: Newark; Supplier Part Number 2: 53K0141; Supplier 3: Mouser; Supplier Part Number 3: 71-CRCW0805-30.1-E3; AEC Qualified: ?
R8 = CRCW060349R9FKEA: RES, 49.9, 1%, 0.1 W, 0603; Manufacturer: Vishay-Dale; CompType: Resistor; Value: 49.9; Value_Code: 49R9; Tolerance_%: 1; Power_W: 0.1; Value2: 0.1W; VDC_V: 75; TempCo: 100 ppm/C; SizeArea_mm2: 1.28; SizeX_mm: 1.6; SizeY_mm: 0.8; EIA_Code: E96; U/M: EA; AEC Category: Q200; Green_Lifecycle: Active; Green_REACh: Passed; SymbolVersion: 2009-05-29; PartNumber: CRCW060349R9FKEA; PackageReference: 0603; RoHS: Y; Res_ohm: 49.9; Value1: 1%; MountType: SMT; Technology: Thick Film; SizeZ_mm: 1; Published: 2008-06-26; Publisher: Texas Instruments; LatestRevisionDate: 2017-06-13; ComponentLink1Description: Datasheet link; ComponentLink1URL: http://www.vishay.com/docs/20035/dcrcwe3.pdf; Supplier 1: Digi-Key; Supplier Part Number 1: 541-49.9HCT-ND; Supplier 2: Newark; Supplier Part Number 2: 52K8566; Supplier 3: Mouser; Supplier Part Number 3: 71-CRCW0603-49.9-E3; AEC Qualified: ?; Green_EU RoHS: Passed with Exemption; Green_EU RoHS-2: Passed
R9 = CRCW060349R9FKEA: RES, 49.9, 1%, 0.1 W, 0603; Manufacturer: Vishay-Dale; CompType: Resistor; Value: 49.9; Value_Code: 49R9; Tolerance_%: 1; Power_W: 0.1; Value2: 0.1W; VDC_V: 75; TempCo: 100 ppm/C; EIA_Code: E96; U/M: EA; SymbolVersion: 2009-05-29; PartNumber: CRCW060349R9FKEA; PackageReference: 0603; RoHS: Y; Res_ohm: 49.9; Value1: 1%; MountType: SMT; Technology: Thick Film; Published: 2008-06-26; Publisher: Texas Instruments; LatestRevisionDate: 2014-12-01; ComponentLink1Description: Datasheet link; ComponentLink1URL: http://www.vishay.com/docs/20035/dcrcwe3.pdf; Supplier 1: Digi-Key; Supplier Part Number 1: 541-49.9HCT-ND; Supplier 2: Mouser; Supplier Part Number 2: 71-CRCW0603-49.9-E3; Supplier 3: Farnell; Supplier Part Number 3: 1469817
R11 R12 R15 R16 = CRCW06030000Z0EA: RES, 0, 5%, 0.1 W, 0603; Manufacturer: Vishay-Dale; CompType: Resistor; Value: 0; Value_Code: 0000; Tolerance_%: 5; Power_W: 0.1; Value2: 0.1W; VDC_V: 75; TempCo: 200 ppm/C; SizeArea_mm2: 1.28; SizeX_mm: 1.6; SizeY_mm: 0.8; SizeZ_mm: 1; EIA_Code: E24; U/M: EA; AEC Category: Q200; Green_Lifecycle: Active; Green_REACh: Passed; SymbolVersion: 2009-05-29; PartNumber: CRCW06030000Z0EA; PackageReference: 0603; RoHS: Y; Res_ohm: 0; Value1: 5%; MountType: SMT; Technology: Thick Film; Published: 2008-06-26; Publisher: Texas Instruments; LatestRevisionDate: 2017-06-13; ComponentLink1Description: Datasheet link; ComponentLink1URL: http://www.vishay.com/docs/20035/dcrcwe3.pdf; Supplier 1: Digi-Key; Supplier Part Number 1: 541-0.0GCT-ND; Supplier 2: Newark; Supplier Part Number 2: 52K8014; Supplier 3: Mouser; Supplier Part Number 3: 71-CRCW0603-0-E3; AEC Qualified: ?; Green_EU RoHS: Passed with Exemption; Green_EU RoHS-2: Passed
R13 = CRCW0603115KFKEA: RES, 115 k, 1%, 0.1 W, 0603; Manufacturer: Vishay-Dale; CompType: Resistor; Value: 115k; Res_ohm: 115000; Tolerance_%: 1; Power_W: 0.1; Value2: 0.1W; VDC_V: 75; TempCo: 100 ppm/C; SizeArea_mm2: 1.28; SizeX_mm: 1.6; SizeY_mm: 0.8; EIA_Code: E96; U/M: EA; AEC Category: Q200; Green_Lifecycle: Active; Green_REACh: Passed; SymbolVersion: 2009-05-29; PartNumber: CRCW0603115KFKEA; PackageReference: 0603; RoHS: Y; Value_Code: 115k; Value1: 1%; MountType: SMT; Technology: Thick Film; SizeZ_mm: 1; Published: 2008-06-26; Publisher: Texas Instruments; LatestRevisionDate: 2017-06-13; ComponentLink1Description: Datasheet link; ComponentLink1URL: http://www.vishay.com/docs/20035/dcrcwe3.pdf; Supplier 1: Digi-Key; Supplier Part Number 1: 541-115KHCT-ND; Supplier 2: Newark; Supplier Part Number 2: 52K8099; Supplier 3: Mouser; Supplier Part Number 3: 71-CRCW0603-115K-E3; AEC Qualified: ?; Green_EU RoHS: Passed with Exemption; Green_EU RoHS-2: Passed
R14 = CRCW0603100KFKEA: RES, 100 k, 1%, 0.1 W, 0603; Manufacturer: Vishay-Dale; CompType: Resistor; Value: 100k; Res_ohm: 100000; Tolerance_%: 1; Power_W: 0.1; Value2: 0.1W; VDC_V: 75; TempCo: 100 ppm/C; SizeArea_mm2: 1.28; SizeX_mm: 1.6; SizeY_mm: 0.8; EIA_Code: E96; U/M: EA; AEC Category: Q200; Green_Lifecycle: Active; Green_REACh: Passed; SymbolVersion: 2009-05-29; PartNumber: CRCW0603100KFKEA; PackageReference: 0603; RoHS: Y; Value_Code: 100k; Value1: 1%; MountType: SMT; Technology: Thick Film; SizeZ_mm: 1; Published: 2008-06-26; Publisher: Texas Instruments; LatestRevisionDate: 2017-06-13; ComponentLink1Description: Datasheet link; ComponentLink1URL: http://www.vishay.com/docs/20035/dcrcwe3.pdf; Supplier 1: Digi-Key; Supplier Part Number 1: 541-100KHCT-ND; Supplier 2: Newark; Supplier Part Number 2: 42K3668; Supplier 3: Mouser; Supplier Part Number 3: 71-CRCW0603-100K-E3; AEC Qualified: ?; Green_EU RoHS: Passed with Exemption; Green_EU RoHS-2: Passed
R18 = CRCW0603169KFKEA: RES, 169 k, 1%, 0.1 W, 0603; Manufacturer: Vishay-Dale; CompType: Resistor; Value: 169k; Res_ohm: 169000; Tolerance_%: 1; Power_W: 0.1; Value2: 0.1W; VDC_V: 75; TempCo: 100 ppm/C; SizeArea_mm2: 1.28; SizeX_mm: 1.6; SizeY_mm: 0.8; EIA_Code: E96; U/M: EA; AEC Category: Q200; Green_Lifecycle: Active; Green_REACh: Passed; SymbolVersion: 2009-05-29; PartNumber: CRCW0603169KFKEA; PackageReference: 0603; RoHS: Y; Value_Code: 169k; Value1: 1%; MountType: SMT; Technology: Thick Film; SizeZ_mm: 1; Published: 2008-06-26; Publisher: Texas Instruments; LatestRevisionDate: 2017-06-13; ComponentLink1Description: Datasheet link; ComponentLink1URL: http://www.vishay.com/docs/20035/dcrcwe3.pdf; Supplier 1: Digi-Key; Supplier Part Number 1: 541-169KHCT-ND; Supplier 2: Newark; Supplier Part Number 2: 52K8184; Supplier 3: Mouser; Supplier Part Number 3: 71-CRCW0603-169K-E3; AEC Qualified: ?; Green_EU RoHS: Passed with Exemption; Green_EU RoHS-2: Passed
R19 = CRCW08050000Z0EA: RES, 0, 5%, 0.125 W, 0805; Manufacturer: Vishay-Dale; CompType: Resistor; Value: 0; Value_Code: 0000; Tolerance_%: 5; Power_W: 0.125; Value2: 0.125W; VDC_V: 150; TempCo: 200 ppm/C; SizeArea_mm2: 2.5; SizeX_mm: 2; SizeY_mm: 1.25; SizeZ_mm: 1.45; EIA_Code: E24; U/M: EA; AEC Category: Q200; SymbolVersion: 2009-05-29; PartNumber: CRCW08050000Z0EA; PackageReference: 0805; RoHS: Y; Res_ohm: 0; Value1: 5%; MountType: SMT; Technology: Thick Film; Published: 2008-06-26; Publisher: Texas Instruments; LatestRevisionDate: 2016-08-02; ComponentLink1Description: Datasheet link; ComponentLink1URL: http://www.vishay.com/docs/20035/dcrcwe3.pdf; Supplier 1: Digi-Key; Supplier Part Number 1: 541-0.0ACT-ND; Supplier 2: Mouser; Supplier Part Number 2: 71-CRCW0805-0-E3; Supplier 3: Farnell; Supplier Part Number 3: 1469846; AEC Qualified: ?
R20 = CRCW060313K7FKEA: RES, 13.7 k, 1%, 0.1 W, 0603; Manufacturer: Vishay-Dale; CompType: Resistor; Value: 13.7k; Res_ohm: 13700; Value_Code: 13k7; Tolerance_%: 1; Power_W: 0.1; Value2: 0.1W; VDC_V: 75; TempCo: 100 ppm/C; SizeArea_mm2: 1.28; SizeX_mm: 1.6; SizeY_mm: 0.8; EIA_Code: E96; U/M: EA; AEC Category: Q200; Green_Lifecycle: Active; Green_REACh: Passed; SymbolVersion: 2009-05-29; PartNumber: CRCW060313K7FKEA; PackageReference: 0603; RoHS: Y; Value1: 1%; MountType: SMT; Technology: Thick Film; SizeZ_mm: 1; Published: 2008-06-26; Publisher: Texas Instruments; LatestRevisionDate: 2017-06-13; ComponentLink1Description: Datasheet link; ComponentLink1URL: http://www.vishay.com/docs/20035/dcrcwe3.pdf; Supplier 1: Digi-Key; Supplier Part Number 1: 541-13.7KHCT-ND; Supplier 2: Newark; Supplier Part Number 2: 42K3706; Supplier 3: Mouser; Supplier Part Number 3: 71-CRCW0603-13.7K-E3; AEC Qualified: ?; Green_EU RoHS: Passed with Exemption; Green_EU RoHS-2: Passed
R21 = CRCW060322K6FKEA: RES, 22.6 k, 1%, 0.1 W, 0603; Manufacturer: Vishay-Dale; CompType: Resistor; Value: 22.6k; Res_ohm: 22600; Value_Code: 22k6; Tolerance_%: 1; Power_W: 0.1; Value2: 0.1W; VDC_V: 75; TempCo: 100 ppm/C; SizeArea_mm2: 1.28; SizeX_mm: 1.6; SizeY_mm: 0.8; EIA_Code: E96; U/M: EA; AEC Category: Q200; Green_Lifecycle: Active; Green_REACh: Passed; SymbolVersion: 2009-05-29; PartNumber: CRCW060322K6FKEA; PackageReference: 0603; RoHS: Y; Value1: 1%; MountType: SMT; Technology: Thick Film; SizeZ_mm: 1; Published: 2008-06-26; Publisher: Texas Instruments; LatestRevisionDate: 2017-06-13; ComponentLink1Description: Datasheet link; ComponentLink1URL: http://www.vishay.com/docs/20035/dcrcwe3.pdf; Supplier 1: Digi-Key; Supplier Part Number 1: 541-22.6KHCT-ND; Supplier 2: Newark; Supplier Part Number 2: 52K8290; Supplier 3: Mouser; Supplier Part Number 3: 71-CRCW0603-22.6K-E3; AEC Qualified: ?; Green_EU RoHS: Passed with Exemption; Green_EU RoHS-2: Passed
R22 = CRCW06031K54FKEA: RES, 1.54 k, 1%, 0.1 W, 0603; Manufacturer: Vishay-Dale; CompType: Resistor; Value: 1.54k; Res_ohm: 1540; Value_Code: 1k54; Tolerance_%: 1; Power_W: 0.1; Value2: 0.1W; VDC_V: 75; TempCo: 100 ppm/C; SizeArea_mm2: 1.28; SizeX_mm: 1.6; SizeY_mm: 0.8; EIA_Code: E96; U/M: EA; AEC Category: Q200; Green_Lifecycle: Active; Green_REACh: Passed; SymbolVersion: 2009-05-29; PartNumber: CRCW06031K54FKEA; PackageReference: 0603; RoHS: Y; Value1: 1%; MountType: SMT; Technology: Thick Film; SizeZ_mm: 1; Published: 2008-06-26; Publisher: Texas Instruments; LatestRevisionDate: 2017-06-13; ComponentLink1Description: Datasheet link; ComponentLink1URL: http://www.vishay.com/docs/20035/dcrcwe3.pdf; Supplier 1: Digi-Key; Supplier Part Number 1: 541-1.54KHCT-ND; Supplier 2: Newark; Supplier Part Number 2: 52K8038; Supplier 3: Mouser; Supplier Part Number 3: 71-CRCW0603-1.54K-E3; AEC Qualified: ?; Green_EU RoHS: Passed with Exemption; Green_EU RoHS-2: Passed
R23 = Resistor: RES, xxx ohm, x%, xW, [PackageReference]; Manufacturer: Used in BOM report; U/M: EA; CompType: Resistor; SymbolVersion: 2009-05-29; Value: DNP; PackageReference: Used in PnP output and some BOM reports; PartNumber: DNP; RoHS: Used in BOM report.  Use Y or N.; MountType: SMT or TH (used in PnP report); ComponentLink1Description: Datasheet Link; ComponentLink1URL: Paste URL for datasheet here; Publisher: Texas Instruments; LatestRevisionDate: 2017-05-31; LatestRevisionNote: Added Alternate PartNumber and Alternate Manufacturer parameters to appropriate components.; Alternate Manufacturer: -; Alternate PartNumber: -
R24 R30 = CRCW06033K01FKEA: RES, 3.01 k, 1%, 0.1 W, 0603; Manufacturer: Vishay-Dale; CompType: Resistor; Value: 3.01k; Res_ohm: 3010; Value_Code: 3k01; Tolerance_%: 1; Power_W: 0.1; Value2: 0.1W; VDC_V: 75; TempCo: 100 ppm/C; SizeArea_mm2: 1.28; SizeX_mm: 1.6; SizeY_mm: 0.8; EIA_Code: E96; U/M: EA; AEC Category: Q200; Green_Lifecycle: Active; Green_REACh: Passed; SymbolVersion: 2009-05-29; PartNumber: CRCW06033K01FKEA; PackageReference: 0603; RoHS: Y; Value1: 1%; MountType: SMT; Technology: Thick Film; SizeZ_mm: 1; Published: 2008-06-26; Publisher: Texas Instruments; LatestRevisionDate: 2017-06-13; ComponentLink1Description: Datasheet link; ComponentLink1URL: http://www.vishay.com/docs/20035/dcrcwe3.pdf; Supplier 1: Digi-Key; Supplier Part Number 1: 541-3.01KHCT-ND; Supplier 2: Newark; Supplier Part Number 2: 52K8370; Supplier 3: Mouser; Supplier Part Number 3: 71-CRCW0603-3.01K-E3; AEC Qualified: ?; Green_EU RoHS: Passed with Exemption; Green_EU RoHS-2: Passed
R25 R26 = ERJ-6RQF3R3V: RES, 3.30, 1%, 0.125 W, 0805; Manufacturer: Panasonic; CompType: Resistor; Value: 3.30; Res_ohm: 3.3; Value_Code: 3R30; Tolerance_%: 1; Power_W: 0.125; Value2: 0.125W; TempCo: 200 ppm/C; SizeArea_mm2: 2.5; SizeX_mm: 2; SizeY_mm: 1.25; SizeZ_mm: 1.45; U/M: EA; AEC Category: Q200; SymbolVersion: 2009-05-29; PartNumber: ERJ-6RQF3R3V; PackageReference: 0805; RoHS: Y; Value1: 1%; MountType: SMT; Technology: Thick Film; Published: 2008-06-26; Publisher: Texas Instruments; LatestRevisionDate: 2017-06-23; ComponentLink1Description: Datasheet link; ComponentLink1URL: http://www.panasonic.com/industrial/components/pdf/AOA0000CE3.pdf; Supplier 1: Digi-Key; Supplier Part Number 1: P3.3DCT-ND; Supplier 2: Mouser; Supplier Part Number 2: 667-ERJ-6RQF3R3V; Supplier 3: Farnell; Supplier Part Number 3: 1717805; AEC Qualified: ?
R27 = CRCW060332K4FKEA: RES, 32.4 k, 1%, 0.1 W, 0603; Manufacturer: Vishay-Dale; CompType: Resistor; Value: 32.4k; Res_ohm: 32400; Value_Code: 32k4; Tolerance_%: 1; Power_W: 0.1; Value2: 0.1W; VDC_V: 75; TempCo: 100 ppm/C; SizeArea_mm2: 1.28; SizeX_mm: 1.6; SizeY_mm: 0.8; EIA_Code: E96; U/M: EA; AEC Category: Q200; Green_Lifecycle: Active; Green_REACh: Passed; SymbolVersion: 2009-05-29; PartNumber: CRCW060332K4FKEA; PackageReference: 0603; RoHS: Y; Value1: 1%; MountType: SMT; Technology: Thick Film; SizeZ_mm: 1; Published: 2008-06-26; Publisher: Texas Instruments; LatestRevisionDate: 2017-06-13; ComponentLink1Description: Datasheet link; ComponentLink1URL: http://www.vishay.com/docs/20035/dcrcwe3.pdf; Supplier 1: Digi-Key; Supplier Part Number 1: 541-32.4KHCT-ND; Supplier 2: Newark; Supplier Part Number 2: 52K8423; Supplier 3: Mouser; Supplier Part Number 3: 71-CRCW0603-32.4K-E3; AEC Qualified: ?; Green_EU RoHS: Passed with Exemption; Green_EU RoHS-2: Passed
R28 = CRCW060344K2FKEA: RES, 44.2 k, 1%, 0.1 W, 0603; Manufacturer: Vishay-Dale; CompType: Resistor; Value: 44.2k; Res_ohm: 44200; Value_Code: 44k2; Tolerance_%: 1; Power_W: 0.1; Value2: 0.1W; VDC_V: 75; TempCo: 100 ppm/C; SizeArea_mm2: 1.28; SizeX_mm: 1.6; SizeY_mm: 0.8; EIA_Code: E96; U/M: EA; AEC Category: Q200; Green_Lifecycle: Active; Green_REACh: Passed; SymbolVersion: 2009-05-29; PartNumber: CRCW060344K2FKEA; PackageReference: 0603; RoHS: Y; Value1: 1%; MountType: SMT; Technology: Thick Film; SizeZ_mm: 1; Published: 2008-06-26; Publisher: Texas Instruments; LatestRevisionDate: 2017-06-13; ComponentLink1Description: Datasheet link; ComponentLink1URL: http://www.vishay.com/docs/20035/dcrcwe3.pdf; Supplier 1: Digi-Key; Supplier Part Number 1: 541-44.2KHCT-ND; Supplier 2: Newark; Supplier Part Number 2: 52K8533; Supplier 3: Mouser; Supplier Part Number 3: 71-CRCW0603-44.2K-E3; AEC Qualified: ?; Green_EU RoHS: Passed with Exemption; Green_EU RoHS-2: Passed
T1 = CMP-0088528-1: TRANSFORMER; Manufacturer: Wurth Electronics; SizeZ_mm: 25.2mm; DCR_ohm: 6.32; Rsec1_ohm: 0.094; Voltage_Isolation_Vrms: 3kV; Ind_H: 2mH; Ns1toNp: 1:1/5.67:1/6.8:1/8.1:1/10:1; Frequency_Fixed: 80kHz; AEC Qualified: No; PackageReference: PTH_TRANSFORMER; Datasheet Path: datasheets/Trans-750319024r00.pdf; RoHS: TRUE; Operating Temperature Range: -40°C to +125°C; Lead Free: Yes; helpURL: https://upverter.com/upn/revision/be9802b5c4ace36f/; PartNumber: 750319024r00
TP1 TP2 TP4 TP7 TP9 TP10 = 5000: Test Point, Miniature, Red, TH; Manufacturer: Keystone; CompType: Test Point Loop; ContactFinish: Silver; Green_Lifecycle: Active; Green_REACh: Passed; SymbolVersion: 2008-04-04; PartNumber: 5000; PackageReference: Red Miniature Testpoint; RoHS: Y; MountType: TH; ComponentLink1Description: Datasheet URL; ComponentLink1URL: http://www.keyelco.com/userAssets/file/M60-2p60.pdf; Color: Red; Publisher: Texas Instruments; LatestRevisionDate: 2017-05-11; Supplier 1: Digi-Key; Supplier Part Number 1: 36-5000-ND; Supplier 2: Mouser; Supplier Part Number 2: 534-5000; Green_EU RoHS: Passed; Green_EU RoHS-2: Incomplete
TP3 TP5 TP6 TP8 TP12 = 5001: Test Point, Miniature, Black, TH; Manufacturer: Keystone; CompType: Test Point Loop; ContactFinish: Silver; Green_Lifecycle: Active; Green_REACh: Passed; SymbolVersion: 2008-04-04; PartNumber: 5001; PackageReference: Black Miniature Testpoint; RoHS: Y; MountType: TH; ComponentLink1Description: Datasheet URL; ComponentLink1URL: http://www.keyelco.com/userAssets/file/M60-2p60.pdf; Color: Black; Publisher: Texas Instruments; LatestRevisionDate: 2017-05-11; Supplier 1: Digi-Key; Supplier Part Number 1: 36-5001-ND; Supplier 2: Mouser; Supplier Part Number 2: 534-5001; Green_EU RoHS: Passed; Green_EU RoHS-2: Incomplete
TP11 = 5000: Test Point, Miniature, Red, TH; Manufacturer: Keystone; CompType: Test Point Loop; U/M: EA; SymbolVersion: 2008-04-04; PartNumber: 5000; PackageReference: Red Miniature Testpoint; RoHS: Y; MountType: TH; ComponentLink1Description: Datasheet Link; ComponentLink1URL: http://www.keyelco.com/userAssets/file/M60-2p60.pdf; Value: Red; Publisher: Texas Instruments; LatestRevisionDate: 2014-11-26; Supplier 1: Digi-Key; Supplier Part Number 1: 5000K-ND
TP13 = 5001: Test Point, Miniature, Black, TH; Manufacturer: Keystone; CompType: Test Point Loop; U/M: EA; SymbolVersion: 2008-04-04; PartNumber: 5001; PackageReference: Black Miniature Testpoint; RoHS: Y; MountType: TH; ComponentLink1Description: Datasheet Link; ComponentLink1URL: http://www.keyelco.com/userAssets/file/M60-2p60.pdf; Value: Black; Publisher: Texas Instruments; LatestRevisionDate: 2014-11-26; Supplier 1: Digi-Key; Supplier Part Number 1: 5001K-ND
U1 = CMP-0073969-3: 4.5V to 28V Input, 2A Output, EMI Friendly Synchronous Step-Down Converter, DDC0006A (SOT-23-THIN-6); Alternate PartNumber: TPS54202DDCT; Manufacturer: Texas Instruments; SizeZ_mm: 0.87; SizeX_mm: 1.65; SizeY_mm: 2.95; SizeArea_mm2: 4.8675; CompType: IC; SizeAreaWB_mm2: 10.4675; AEC Category: Q200; AEC Qualified: N; Rating: Catalog; ComponentLink1URL: http://www.ti.com/lit/ds/symlink/tps54202.pdf; PackageDescription: SOT-23-THIN-6; PackageReference: DDC0006A; RoHS: Y; MountType: SMT; PartNumber: TPS54202DDCR; Alternate Manufacturer: Texas Instruments; ComponentLink1Description: Datasheet Link; ComponentLink2Description: Product Folder; ComponentLink2URL: http://www.ti.com/product/tps54202; ComponentLink3Description: Online Datasheet; ComponentLink3URL: http://www.ti.com/product/tps54202/datasheet; Operating Temperature Range: -40 to 125 C
U2 = CMP-0078369-2: High-Efficiency Low-Cost Flyback Controller with Secondary-Side Regulation, DBV0006A (SOT-23-6); Manufacturer: Texas Instruments; SizeZ_mm: 1.45; SizeX_mm: 2.8; SizeY_mm: 2.9; AEC Category: Q200; AEC Qualified: N; SizeArea_mm2: 8.12; CompType: IC; SizeAreaWB_mm2: 14.82; ComponentLink1URL: https://sps16.itg.ti.com/sites/KMS/crossdivteams/altium/docs/ComponentDatasheets/UCC28742_ds(preliminary)_20171023.pdf; PackageDescription: SOT-23-6; ComponentLink2URL: TBD; PackageReference: DBV0006A; ComponentLink2Description: Product Folder; PartNumber: UCC28742DBVR; MountType: SMT; ComponentLink1Description: Datasheet Link; Alternate Manufacturer: Texas Instruments; ComponentLink3Description: Online Datasheet; ComponentLink3URL: http://www.ti.com/product/GPN/datasheet
U3 = CMP-0084731-1: High Bandwidth Low-Iq Programmable Shunt Regulator, DBZ0003A (SOT-23-3); Manufacturer: Texas Instruments; CompType: IC; SizeX_mm: 2.5; AEC Category: Q200; SizeY_mm: 3; SizeArea_mm2: 7.5; AEC Qualified: N; SizeZ_mm: 1.12; SizeAreaWB_mm2: 14; ComponentLink3URL: http://www.ti.com/product/atl431li/datasheet; ComponentLink1Description: Datasheet Link; MountType: SMT; ComponentLink2Description: Product Folder; ComponentLink2URL: http://www.ti.com/product/atl431li; ComponentLink1URL: http://www.ti.com/lit/ds/symlink/atl431li.pdf; PackageDescription: SOT-23-3; PartNumber: ATL431LIBQDBZR; Alternate Manufacturer: Texas Instruments; PackageReference: DBZ0003A; ComponentLink3Description: Online Datasheet